# EAGLE design USBSocket_Type2_v1.0 (EAGLE 9.6.2)
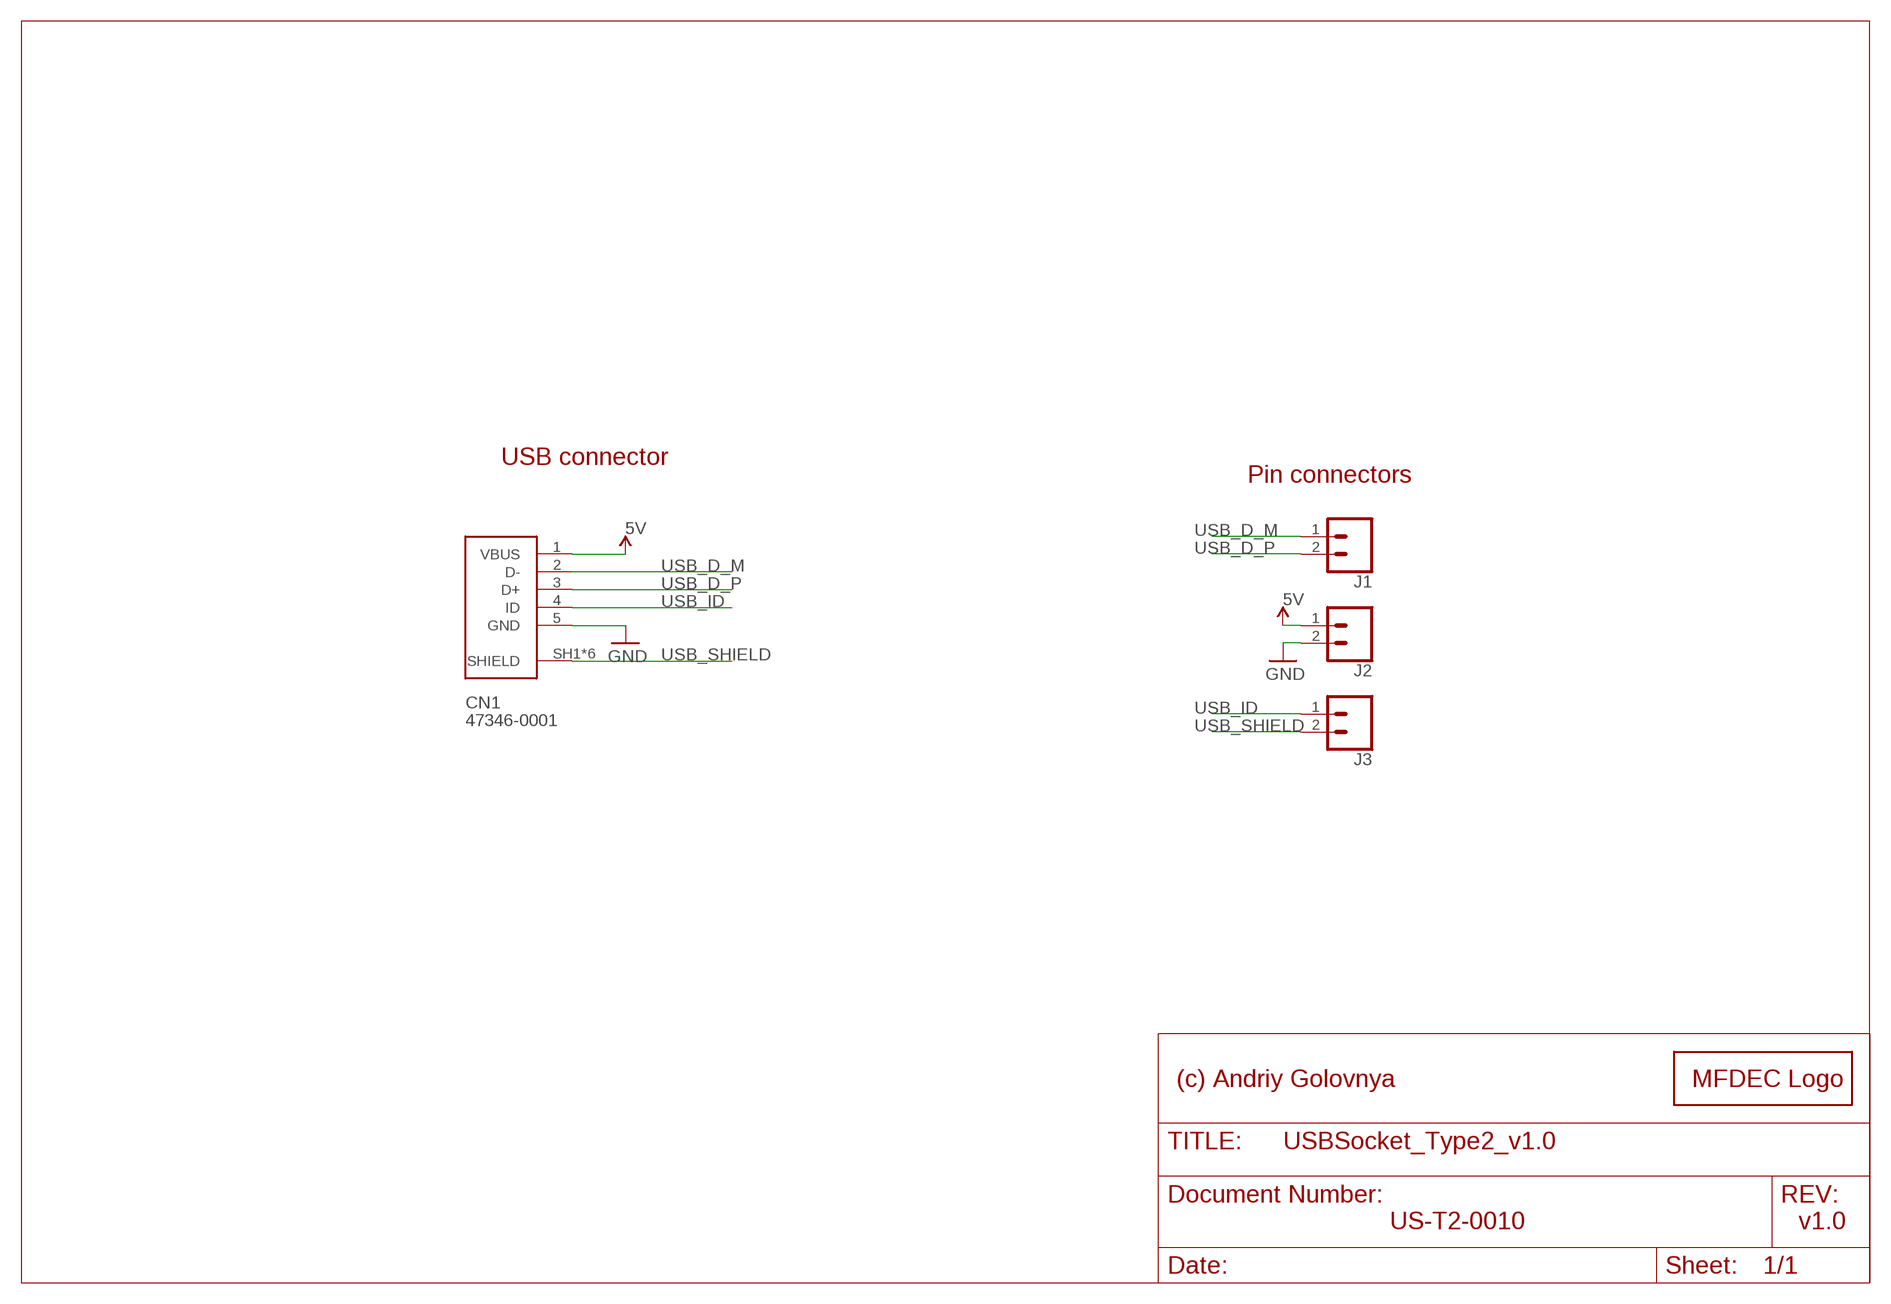
[diagram p0: schematic, sheet 1]

## Parts
CN1  47346-0001  [MOLEX_47346-0001]
J1  CONN_02  [1X02]
J2  CONN_02  [1X02]
J3  CONN_02  [1X02]
LOGO1  MFDECLOGO_L_10MM  [MFDEC_L_10MM]

## Nets
5V [POWER]: CN1.1(VBUS) J2.1
GND [POWER]: CN1.5(GND) J2.2
USB_D_M [XUSB]: CN1.2(D-) J1.1
USB_D_P [XUSB]: CN1.3(D+) J1.2
USB_ID: CN1.4(ID) J3.1
USB_SHIELD: CN1.SH1(SHIELD) CN1.SH2(SHIELD) CN1.SH3(SHIELD) CN1.SH4(SHIELD) CN1.SH5(SHIELD) CN1.SH6(SHIELD) J3.2

## Notes on the sheet
- USB connector
- Pin connectors
- (c) Andriy Golovnya
- US-T2-0010 | v1.0

## Library data of the parts
CN1 = SnapEDA-Library:47346-0001: CONN RCPT 5POS MICRO USB R/A SMD; MANUFACTURER: Molex
J1-J3 = SparkFun-Connectors:CONN_02: Multi connection point. Often used as Generic Header-pin footprint for 0.1 inch spaced/style header connections On any of the 0.1 inch spaced packages, you can populate with these: Break Away Headers - Straight <https://www.sparkfun.com/products/116> (PRT-00116) Break Away Male Headers - Right Angle <https://www.sparkfun.com/products/553> (PRT-00553) Female Headers <https://www.sparkfun.com/products/115> (PRT-00115) Break Away Headers - Machine Pin <https://www.sparkfun.com/products/117> (PRT-00117) Break Away Female Headers - Swiss Machine Pin <https://www.sparkfun.com/products/743> (PRT-00743) For SCREWTERMINALS and SPRING TERMINALS visit here: Screw Terimnals on SparkFun.com <https://www.sparkfun.com/search/results?term=Screw+Terminals> (5mm/3.5mm/2.54mm spacing) This device is also useful as a general connection point to wire up your design to another part of your project. Our various solder wires solder well into these plated through hole pads. Hook-Up Wire - Assortment (Stranded, 22 AWG) <https://www.sparkfun.com/products/11375> (PRT-11375) Hook-Up Wire - Assortment (Solid Core, 22 AWG) <https://www.sparkfun.com/products/11367> (PRT-11367) View the entire wire category on our website here <https://www.sparkfun.com/categories/141> Special notes: Molex polarized connector foot print use with: PRT-08233 with associated crimp pins and housings. 2.54_SCREWTERM for use with PRT-10571. 3.5mm Screw Terminal footprints for PRT-08084 5mm Screw Terminal footprints for use with PRT-08432
LOGO1 = _my_logos:MFDECLOGO: Midnight Fog - Digital Eye Candy LOGO

## Net classes
1 XUSB: width 0.305 mm
2 USB: width 0.305 mm
3 POWER: width 0.305 mm

## Board
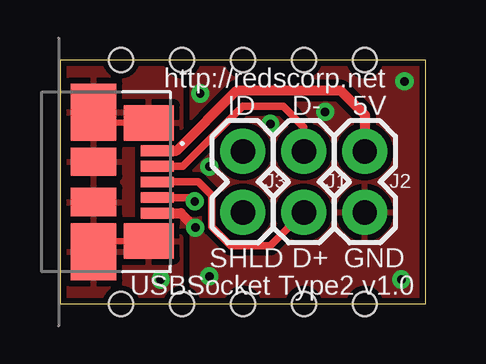
[diagram p1: board, top side]
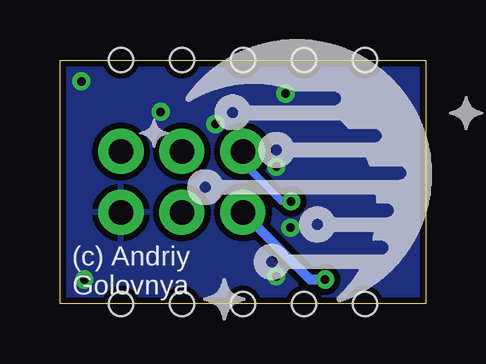
[diagram p2: board, bottom side, seen from below]

Size 15.24 x 10.16 mm. Coordinates in mm from the lower left corner, seen from the top.
Outline: 0,0 15.24,0 15.24,10.16 0,10.16 0,0
Copper layers (1*16): Top 0.035mm / dielectric 1.5mm / Bottom 0.035mm
Design rules "default *": minimum track width 6mil, minimum drill 0.35mm, track to track 6mil, track to pad 6mil, pad to pad 6mil, via to via 6mil, smd to smd 6mil, copper to edge 10mil, drill to drill 6mil, minimum pad ring 10mil, minimum via ring 8mil, stop-mask expansion 4mil, vias tented up to drill 20mil, thermal gap 10mil
Holes 1 mm at 12.7,0 10.16,0 7.62,0 5.08,0 2.54,0 2.54,10.16 5.08,10.16 7.62,10.16 10.16,10.16 12.7,10.16

### Footprints (pad centres in the part's own frame; a part is rotated, then mirrored left to right if it is on the bottom)
MOLEX_47346-0001 = smd 0.45 x 1.38: 1 -1.3,2.66; 2 -0.65,2.66; 3 0,2.66; 4 0.65,2.66; 5 1.3,2.66 | smd 1.475 x 2.1: SH1 -2.462,2.3; SH2 2.462,2.3 | smd 2.375 x 1.9: SH3 -2.913,0; SH6 2.913,0 | smd 1.175 x 1.9: SH4 -0.838,0; SH5 0.838,0
1X02 = drill 1.016 pad 1.88: 1 0,0; 2 2.54,0

### Placement (x,y rotation side)
CN1  1.4,5.08 270 top
J1  10.16,6.35 270 top
J2  12.7,6.35 270 top
J3  7.62,6.35 270 top
LOGO1  -3.17,11.94 180 bottom  (outside the outline)

### Tracks (layer width: path | path; a pad name or v marks a point on that pad's centre or on a via)
5V
  Top 0.406: CN1.1 4.86,6.38 7.37,8.89 11.68,8.89 12.7,7.87 J2.1
GND  (via drill 0.35)
  Top 0.406: CN1.5 5.03,3.78 v5.64,3.17
  other vias: 8.76,7.49 5.84,8.76 6.22,1.14 14.22,1.02 14.35,9.27 6.22,5.71 11.05,8
  pour Top (isolate 0.254, rank 2): 0,0 21.34,0 21.34,10.16 0,10.16
  pour Bottom (isolate 0.254, rank 2): 0,0 18.16,0 18.16,10.16 0,10.16
USB_D_M
  Top 0.305: CN1.2 5.11,5.73 7.61,8.23 9.3,8.23 10.16,7.37 J1.1
USB_D_P
  Top 0.305: CN1.3 5.77,5.08 6.32,4.53 6.32,3.2 7.11,2.41 8.76,2.41 J1.2
USB_ID  (via drill 0.35)
  Top 0.305: CN1.4 5.45,4.43 v5.61,4.27
  Bottom 0.305: J3.1 7.62,5.9 5.99,4.27 v5.61,4.27
USB_SHIELD  (via drill 0.35)
  Top 0.254: CN1.SH1 1.85,7.54 CN1.SH3 | CN1.SH2 1.85,2.62 CN1.SH6
  Bottom 0.406: J3.2 4.83,1.02 v4.19,1.02
  pour Top (isolate 0.254): 3.05,6.86 5.08,6.86 5.08,10.16 0,10.16 0,0 5.08,0 5.08,3.3 3.05,3.3

### Text on the board
tPlace: http://redscorp.net | ID | D- | 5V | SHLD | D+ | GND | USBSocket Type2 v1.0
bPlace: (c) Andriy / Golovnya